# Altium schematic sheet 2xparallelswitch.SchDoc: RP2040 CNC
size B; Author: AM; CompanyName: Expatria Technologies; DrawnBy: A.Marles; Engineer: AM; Organization: Expatria Technolgoies; DocumentNumber: 13; SheetNumber: 13; SheetTotal: 14
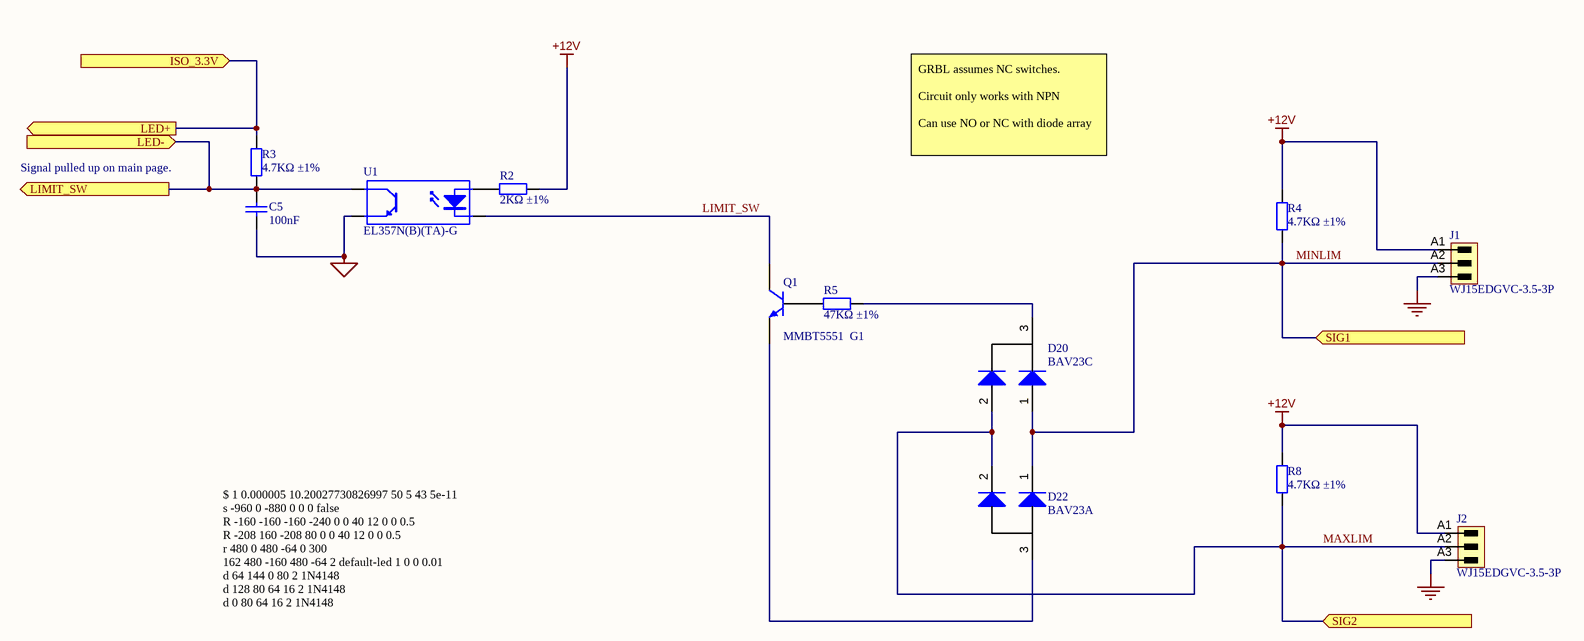
[diagram p0: 2xparallelswitch.SchDoc]

## Parts
C5  100nF  [0603_C]
D20  BAV23C  [SOT-23(SOT-23-3)]
D22  BAV23A  [SOT-23(SOT-23-3)]
J1  WJ15EDGVC-3.5-3P  [691321100003 - 3.5mm  3p]
J2  WJ15EDGVC-3.5-3P  [691321100003 - 3.5mm  3p]
Q1  MMBT5551  G1  [SOT-23(SOT-23-3)]
R2  2KΩ ±1%  [0603_R]
R3  4.7KΩ ±1%  [0603_R]
R4  4.7KΩ ±1%  [0603_R]
R5  47KΩ ±1%  [0603_R]
R8  4.7KΩ ±1%  [0603_R]
U1  EL357N(B)(TA)-G  [SOP-4_P2.54]

## Ports
ISO_3.3V (in), LED+ (out), LED- (in), LIMIT_SW (out), SIG1 (in), SIG2 (in)

## Nets
+12V: J1.A1 J2.A1 R2.2 R4.2 R8.2
GND: J1.A3 J2.A3
MCU_GND: C5.1 U1.3(E)
ISO_3.3V: R3.2 ; port LED+, port ISO_3.3V
LED-: C5.2 R3.1 U1.4(C) ; port LIMIT_SW, port LED-
LIMIT_SW: Q1.3(C) U1.2(K)
MAXLIM: D20.2(A) D22.2(K) J2.A2 R8.1 ; port SIG2
MINLIM: D20.1(A) D22.1(K) J1.A2 R4.1 ; port SIG1
NetD20_3: D20.3(K) R5.1
NetD22_3: D22.3(A) Q1.2(E)
NetQ1_1: Q1.1(B) R5.2
NetR2_1: R2.1 U1.1(A)

## Notes on the sheet
- Signal pulled up on main page.
- GRBL assumes NC switches.
  Circuit only works with NPN
  Can use NO or NC with diode array
- $ 1 0.000005 10.20027730826997 50 5 43 5e-11
  s -960 0 -880 0 0 0 false
  R -160 -160 -160 -240 0 0 40 12 0 0 0.5
  R -208 160 -208 80 0 0 40 12 0 0 0.5
  r 480 0 480 -64 0 300
  162 480 -160 480 -64 2 default-led 1 0 0 0.01
  d 64 144 0 80 2 1N4148
  d 128 80 64 16 2 1N4148
  d 0 80 64 16 2 1N4148
  d 64 144 128 80 2 1N4148
  w -208 240 -64 240 0
  w -208 -48 -64 -48 0
  r -208 -160 -208 -48 0 4700
  r -208 240 -208 160 0 4700
  w -272 240 -208 240 0
  r -816 -128 -816 -16 0 4700
  368 560 0 640 0 0 0
  w 128 80 176 80 0
  w 176 80 176 -48 0
  w -64 -48 176 -48 0
  w -64 240 -64 80 0
  w -64 80 0 80 0
  t 432 16 480 16 0 1 -1.9259651808153881 0.6654412315562044 100 default
  w -208 -160 -160 -160 0
  w 480 32 480 112 0
  w 64 16 320 16 0
  r 320 16 432 16 0 47000
  w 480 -160 560 -160 0
  w 480 0 560 0 0
  w 64 144 480 144 0
  w 480 112 480 144 0
  t -880 0 -816 0 0 1 0.5853792388006339 0.6306931131090543 100 default
  r -736 -16 -816 -16 0 330
  g -816 96 -816 160 0 0
  r -960 0 -1056 0 0 4700
  R -1056 0 -1056 -80 0 0 40 4 0 0 0.5
  368 432 16 432 -32 0 0
  w -160 -160 -64 -160 0
  w -64 -160 480 -160 0
  R -816 -128 -816 -208 0 0 40 12 0 0 0.5
  r -816 16 -816 96 0 5
  w -272 240 -272 368 0
  g -144 16 -176 16 0 0
  r -144 16 -64 16 0 400
  r -144 16 -144 80 0 4700
  R -144 80 -144 112 0 0 40 12 0 0 0.5
  s -64 16 -64 -48 0 1 false
  368 -64 -48 -64 -96 0 0
  s -736 -16 -672 -16 0 1 false
  w -208 -48 -272 -48 0
  w -496 -48 -432 -48 0
  w -496 368 -432 368 0
  s -432 -48 -272 -48 0 0 false
  s -432 368 -272 368 0 0 false
  s -672 400 -752 400 0 0 false
  r -752 400 -752 480 0 1
  g -752 480 -752 544 0 0
  g -496 128 -496 192 0 0
  w -672 -16 -592 -16 0
  370 -496 -16 -496 64 1 0 0
  r -576 -320 -576 -256 0 2000
  R -576 -320 -576 -368 0 0 40 12 0 0 0.5
  162 -576 -256 -576 -176 2 default-led 1 0 0 0.01
  w -592 -16 -592 -32 0
  368 -592 -32 -592 -80 0 0
  f -624 -160 -576 -160 32 1.5 0.00125
  g -576 -144 -576 -112 0 0
  w -672 -16 -672 -160 0
  r -544 -32 -592 -32 0 2000
  w -672 -160 -624 -160 0
  t -544 -32 -496 -32 0 -1 11.999998764889913 0.7005262762564612 100 default
  t -544 384 -496 384 0 -1 1.6935934957562468 -0.6687444541435765 100 default
  w -672 256 -624 256 0
  r -544 384 -592 384 0 10000
  w -672 400 -672 256 0
  g -576 272 -576 304 0 0
  f -624 256 -576 256 32 1.5 0.00125
  368 -592 384 -592 336 0 0
  w -592 400 -592 384 0
  162 -576 160 -576 240 2 default-led 1 0 0 0.01
  R -576 96 -576 48 0 0 40 12 0 0 0.5
  r -576 96 -576 160 0 2000
  370 -496 400 -496 480 1 0 0
  w -672 400 -592 400 0
  g -496 480 -496 544 0 0
  r -672 -160 -672 -224 0 100000
  w -672 -224 -672 -320 0
  w -672 -320 -576 -320 0
  r -496 64 -496 128 0 4
  g -416 432 -416 464 0 0
- SHEET
- Expatria Technologies
- 1136 Glade Court
- Port Coquitlam, BC V3B 1R5
- PROJECT
- SIZE
- ENGR
- MODIFIED
- DOCUMENT
- REV
- Copyright Expatria Technologies 2022. This document describes Open Hardware and is licensed under the CERN-OHL-S v2. No warranty is implied or expressed.
- EMAIL: INFO@EXPATRIA.CA
- B
- /

## Library data of the parts
C5 = 0603 100nF (104) 10% 50V: Chip capacitors; Manufacturer: YAGEO; PartNumber: CC0603KRX7R9BB104; Tolerance: 10%; Voltage: 50V; ComponentLink1Description: Supplier link; ComponentLink1URL: http://www.szlcsc.com/product/details_15331.html; Package: 0603; Supplier: LC; SuppliersPartNumber: C14663; Capacitance: 100nF
D20 = SOT-23 BAV23C: 250V +150℃@(Tj) 350mW Dual Common Cathode 1.25V@200mA 50ns 100nA@250V 225mA SOT-23 Switching Diode ROHS; ComponentLink1Description: 供应商链接; ComponentLink1URL: http://www.szlcsc.com/product/details_70091.html; Package: SOT-23; Supplier: LC; SuppliersPartNumber: C545540
D22 = SOT-23 BAV23A: 200V -65℃~+150℃@(Tj) 350mW 1 Pair Common Anode 1.25V@200mA 50ns 100nA@200V 400mA SOT-23 Switching Diode ROHS; ComponentLink1Description: 供应商链接; ComponentLink1URL: http://www.szlcsc.com/product/details_70091.html; Package: SOT-23; Supplier: LC; SuppliersPartNumber: C328584
J1 J2 = 3.5mm Terminal Header 3p: Header,Male Pin,Covered(4 Sided) 3 1 0.138"（3.50mm） 3 P=3.5mm Pluggable System Terminal Block RoHS; Manufacturer: Weidmueller; Manufacturer 1: Weidmuller; Manufacturer Part Number 1: 1604480000; Pitch_mm: 3.5 mm; UL_94_flammability_rating: V-0; Side_termination_characteristic: closed side; Solder_pin_length_mm: 3.2 mm; Short_text_for_material: SL 3.50/03/180G 3.2SN OR BX; Pitch_inch: 0.138 inch; PartNumber: WJ15EDGVC-3.5-3P; PackageReference: SL_3_50_180G_03; ComponentLink1URL: http://www.weidmueller.com/; ComponentLink1Description: Manufacturer URL; Packaging: Box; Revision: V1; SuppliersPartNumber: C192778
Q1 = SOT-23 MMBT5551  G1: 三极管; ComponentLink1Description: 供应商链接; ComponentLink1URL: http://www.szlcsc.com/product/details_2502.html; Package: SOT-23; Supplier: LC; SuppliersPartNumber: C2145
R2 = 0603 2K (2001) 1%: Chip resistor; Manufacturer: Uniroyal Elec; PartNumber: 0603WAF2001T5E; Power: 1/10W; ComponentLink1Description: Supplier link; ComponentLink1URL: http://www.szlcsc.com/product/details_23702.html; Package: 0603; Supplier: LC; SuppliersPartNumber: C22975; Resistance: 2KΩ; Tolerance: 1%
R3 R4 R8 = 0603 4.7K (4701) 1%: Chip resistor; Manufacturer: Uniroyal Elec; PartNumber: 0603WAF4701T5E; Power: 1/10W; ComponentLink1Description: Supplier link; ComponentLink1URL: http://www.szlcsc.com/product/details_23889.html; Package: 0603; Supplier: LC; SuppliersPartNumber: C23162; Resistance: 4.7KΩ; Tolerance: 1%
R5 = 0603 47K (4702) 1%: Chip resistor; Manufacturer: Uniroyal Elec; PartNumber: 0603WAF4702T5E; Power: 1/10W; ComponentLink1Description: Supplier link; ComponentLink1URL: http://www.szlcsc.com/product/details_26562.html; Package: 0603; Supplier: LC; SuppliersPartNumber: C25819; Resistance: 47KΩ; Tolerance: 1%
U1 = EL357N(B)(TA)-G_[C6649]: 贴片光耦; ComponentLink1Description: 供应商链接; ComponentLink1URL: http://www.szlcsc.com/product/details_7114.html; Package: SOP-4_P2.54; Supplier: LC; SuppliersPartNumber: C6649